# Altium schematic sheet 3.Interface1.SchDoc
size A4; DocumentNumber: 4; SheetNumber: 4; SheetTotal: 7
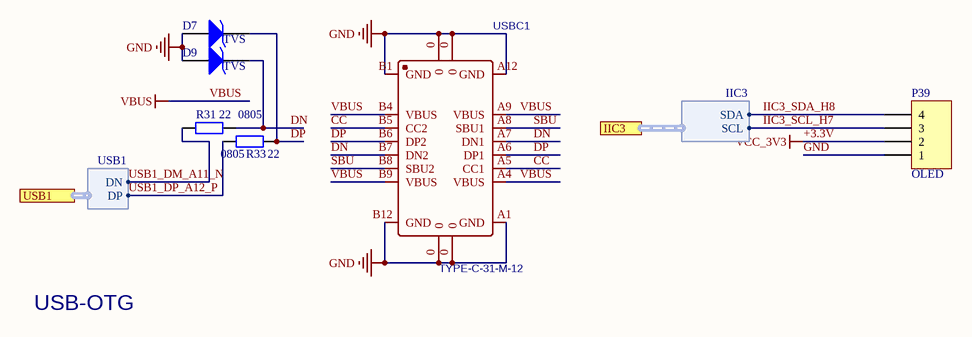
[diagram p0: 3.Interface1.SchDoc]

## Parts
D7  TVS  [SOD-523]
D9  TVS  [SOD-523]
P39  OLED  [HDR1X4]
R31  0805  value 22  [R 0805_L]
R33  0805  value 22  [R 0805_L]
USBC1  TYPE-C-31-M-12  [TYPE-C-USB-17]

## Ports
IIC3 (harness IIC3), USB1 (harness USB1)

## Harnesses
USB1: DN, DP
IIC3: SDA, SCL

## Nets
+3.3V: P39.2  [also labelled VCC_3V3]
GND: D7.1(A) D9.1(A) P39.1 USBC1.0 USBC1.A1(GND) USBC1.A12(GND) USBC1.B1(GND) USBC1.B12(GND)
VBUS: USBC1.A4(VBUS) USBC1.A9(VBUS) USBC1.B4(VBUS) USBC1.B9(VBUS)
CC: USBC1.A5(CC1) USBC1.B5(CC2)
DN: D9.2(K) R31.2 USBC1.A7(DN1) USBC1.B7(DN2)
DP: D7.2(K) R33.2 USBC1.A6(DP1) USBC1.B6(DP2)
IIC3_SCL_H7: P39.3 ; port IIC3.SCL
IIC3_SDA_H8: P39.4 ; port IIC3.SDA
SBU: USBC1.A8(SBU1) USBC1.B8(SBU2)
USB1_DM_A11_N: R31.1 ; port USB1.DN
USB1_DP_A12_P: R33.1 ; port USB1.DP

## Notes on the sheet
- USB-OTG

## Library data of the parts
D7 D9 = D: High Conductance Fast Diode; Published: 8-Jun-2000; LatestRevisionDate: 17-Jul-2002; LatestRevisionNote: Re-released for DXP Platform.; DatasheetVersion: 1997; PackageReference: DO-35; Publisher: Altium Limited; PackageDescription: Diode, Axial; Body 3.8 x 1.9 mm (LxDia. max), Lead Dia. 0.53 mm (max); Code_JEDEC: DO-204-AH; ComponentLink1Description: Manufacturer Link; ComponentLink1URL: http://www.fairchildsemi.com/; ComponentLink2Description: Datasheet; ComponentLink2URL: http://www.fairchildsemi.com/ds/1N%2F1N4148.pdf
P39 = Header 4: Header, 4-Pin; LatestRevisionDate: 17-Jul-2002; LatestRevisionNote: Re-released for DXP Platform.; Publisher: Altium Limited
R31 R33 = RES2: Resistor; Published: 8-Jun-2000; LatestRevisionDate: 17-Jul-2002; LatestRevisionNote: Re-released for DXP Platform.; PackageReference: AXIAL-0.3; Publisher: Altium Limited; PackageDescription: Axial Device, Thru-Hole; 2 Leads; 0.3 in Pin Spacing